# Altium schematic sheet Relay_Channel.SchDoc
size A; SheetNumber: 6; SheetTotal: 10
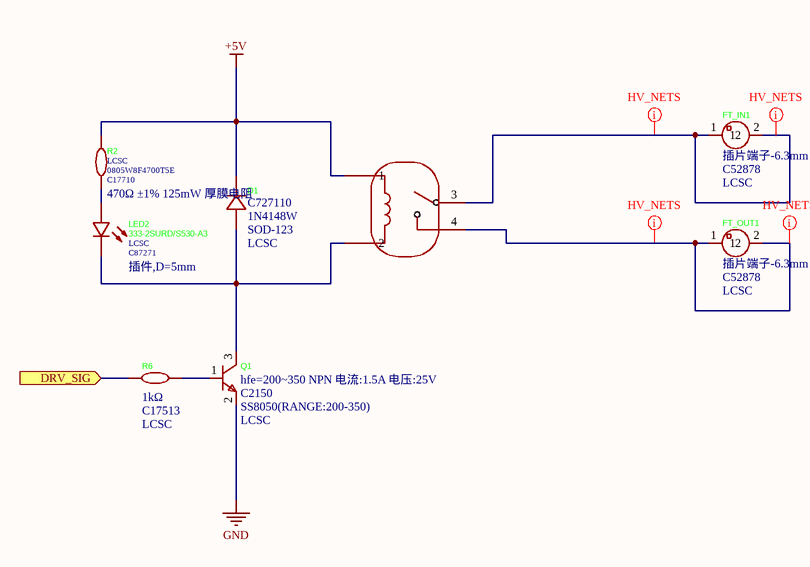
[diagram p0: Relay_Channel.SchDoc]

## Parts
D1  Supplier Part: C727110  Supplier Footprint: SOD-123  Supplier: LCSC  [SOD-123_L3.1-W1.7-LS3.7-RD]  (hidden comment: 1N4148W)
FT_IN1  LCSC Part Name: 插片端子-6.3mm  Supplier Part: C52878  Supplier: LCSC  [CONN-TH_L6.3-W0.8-EST026]  (hidden comment: EST026)
FT_OUT1  LCSC Part Name: 插片端子-6.3mm  Supplier Part: C52878  Supplier: LCSC  [CONN-TH_L6.3-W0.8-EST026]  (hidden comment: EST026)
K1  HF105F-1/005D-1HST  [HF105F-1_005D-1HST1_Update]  (value not drawn)
LED2  333-2SURD/S530-A3  Supplier: LCSC  Supplier Part: C87271  Supplier Footprint: 插件,D=5mm  [LED-TH_BD5.9-P2.54-RD_RED]
Q1  LCSC Part Name: hfe=200~350 NPN 电流:1.5A 电压:25V  Supplier Part: C2150  Supplier: LCSC  [SOT-23-3_L2.9-W1.3-P1.90-LS2.4-BR]  (hidden comment: SS8050(RANGE:200-350))
R2  Supplier: LCSC  Supplier Part: C17710  LCSC Part Name: 470Ω ±1% 125mW 厚膜电阻  [R0805]  (hidden comment: 470Ω)
R6  Supplier Part: C17513  Supplier: LCSC  [R0805]  (hidden comment: 1kΩ)

## Ports
DRV_SIG (in)

## Nets
+5V: D1.1(K) K1.1 R2.2
GND: Q1.2(E)
DRV_SIG: R6.1 ; port DRV_SIG
NetD1_2: D1.2(A) K1.2 LED2.1(C) Q1.3(C)
NetFT_IN1_1: FT_IN1.1 FT_IN1.2 K1.3
NetFT_OUT1_1: FT_OUT1.1 FT_OUT1.2 K1.4
NetLED2_2: LED2.2(A) R2.1
NetQ1_1: Q1.1(B) R6.2

## Layout directives
net class HV_NETS: NetFT_IN1_1, NetFT_OUT1_1

## Library data of the parts
D1 = 1N4148W_C727110: Manufacturer: TWGMC(台湾迪嘉); Current - Rectified: 300mA; Pd - Power Dissipation: 400mW; Reverse Leakage Current (Ir): 1uA; Non-Repetitive Peak Forward Surge Current: 4A; Add into BOM: yes; Diode Configuration: Independent; Voltage - DC Reverse(Vr): 100V; Reverse Recovery Time (trr): 8ns; Operating Junction Temperature Range: -55℃~+150℃@(Tj); Symbol: 1N4148W_C727110; Device: 1N4148W_C727110; LCSC Part Name: 1N4148W; JLCPCB Part Class: Extended Part; Datasheet: https://item.szlcsc.com/datasheet/1N4148W/774215.html; Convert to PCB: yes; Voltage - Forward(Vf@If): -; Manufacturer Part: 1N4148W
FT_IN1 FT_OUT1 = EST026: Manufacturer: xcfuse(旭程); Add into BOM: yes; Symbol: EST026; Device: EST026; Manufacturer Part: EST026; Supplier Footprint: 插件; JLCPCB Part Class: Extended Part; Datasheet: https://item.szlcsc.com/datasheet/EST026/53893.html; Convert to PCB: yes
K1 = HF105F-1/005D-1HST: Manufacturer: HF(宏发); Add into BOM: yes; Coil Voltage: 5V; Contact Form: 1 Set Normally Open: 1A (SPST NO); Contact Rating: 30A@240VAC；20A@28VDC; Switching Voltage(Max): 277V@AC；28V@DC; Coil Rated Power: 900mW; Switching Current(Max): 40A; Coil Type: Non-Polarized - Single Coil; Coil Resistance: 27Ω; Contact Resistance: 50mΩ; Operate Time: 15ms; Release Time: 10ms; Symbol: HF105F-1/005D-1HST; Device: HF105F-1/005D-1HST; LCSC Part Name: 小型大功率5V继电器 单刀单掷-常开; Supplier Part: C2976768; Manufacturer Part: HF105F-1/005D-1HST; Supplier Footprint: 插件,32.3x27.1mm; JLCPCB Part Class: Extended Part; Datasheet: https://item.szlcsc.com/datasheet/HF105F-1%252F005D-1HST/3384988.html; Supplier: LCSC; Convert to PCB: yes; Number of Pins: 4; Contact Material: AgSnO2; Operating Temperature: -55℃~+85℃
LED2 = 333-2SURD/S530-A3: Manufacturer: EVERLIGHT(亿光); Lamp Holder Type: 5 mm round LED; Add into BOM: yes; Illumination Color: Red; Voltage - Forward(Vf): 2V; Forward Current: 20mA; Wavelength - Dominant: 624nm; Peak Wavelength: 632nm; Lens Color: Red Lens; Luminous Intensity: 200mcd; Viewing Angle: 30°; Symbol: 333-2SURD/S530-A3; Device: 333-2SURD/S530-A3; Manufacturer Part: 333-2SURD/S530-A3; LCSC Part Name: 5mm圆形灯头 红色; JLCPCB Part Class: Extended Part; Datasheet: https://en.everlight.com/wp-content/plugins/ItemRelationship/product_files/pdf/333-2SURD-S530-A3.pdf; Convert to PCB: yes
Q1 = SS8050(RANGE:200-350)_C2150: Manufacturer: CJ(江苏长电/长晶); Symbol: SS8050_C2150; Add into BOM: yes; type: NPN; Current - Collector(Ic): 1.5A; Collector - Emitter Voltage VCEO: 25V; Pd - Power Dissipation: 300mW; DC Current Gain: 200@800mA,1V; Transition frequency(fT): 100MHz; Current - Collector Cutoff: 100nA; Vce Saturation(VCE(sat)): 500mV@800mA,80mA; Emitter-Base Voltage(Vebo): 5V; Number: 1 NPN; Device: SS8050(RANGE:200-350)_C2150; Supplier Footprint: SOT-23; JLCPCB Part Class: Basic Part; Datasheet: https://item.szlcsc.com/datasheet/SS8050(RANGE%253A200-350)/2507.html; Convert to PCB: yes; Operating Temperature: -55℃~+150℃; Manufacturer Part: SS8050(RANGE:200-350)
R2 = 0805W8F4700T5E: Manufacturer: UNI-ROYAL(厚声); Add into BOM: yes; Tolerance: ±1%; Power(Watts): 125mW; Voltage-Supply(Max): 150V; Temperature Coefficient: ±100ppm/℃; Symbol: 0805W8F4700T5E; Device: 0805W8F4700T5E; Supplier Footprint: 0805; JLCPCB Part Class: Basic Part; Datasheet: https://item.szlcsc.com/datasheet/0805W8F4700T5E/18398.html; Convert to PCB: yes; Type: Thick Film Resistor; Value: 470Ω; Operating Temperature: -55℃~+155℃; Manufacturer Part: 0805W8F4700T5E
R6 = 0805W8F1001T5E: Manufacturer: UNI-ROYAL(厚声); Add into BOM: yes; Tolerance: ±1%; Temperature Coefficient: ±100ppm/℃; Symbol: 0805W8F1001T5E; Device: 0805W8F1001T5E; Supplier Footprint: 0805; JLCPCB Part Class: Basic Part; Datasheet: https://atta.szlcsc.com/upload/public/pdf/source/20200306/C422600_1E6D84923E4A46A82E41ADD87F860B5C.pdf; Convert to PCB: yes; Type: Thick Film Resistors; Operating Temperature Range: -55℃~+155℃; LCSC Part Name: 1kΩ ±1% 125mW 厚膜电阻; Manufacturer Part: 0805W8F1001T5E; Value: 1kΩ